# EAGLE design LCD-Shield (EAGLE 9.4.0)
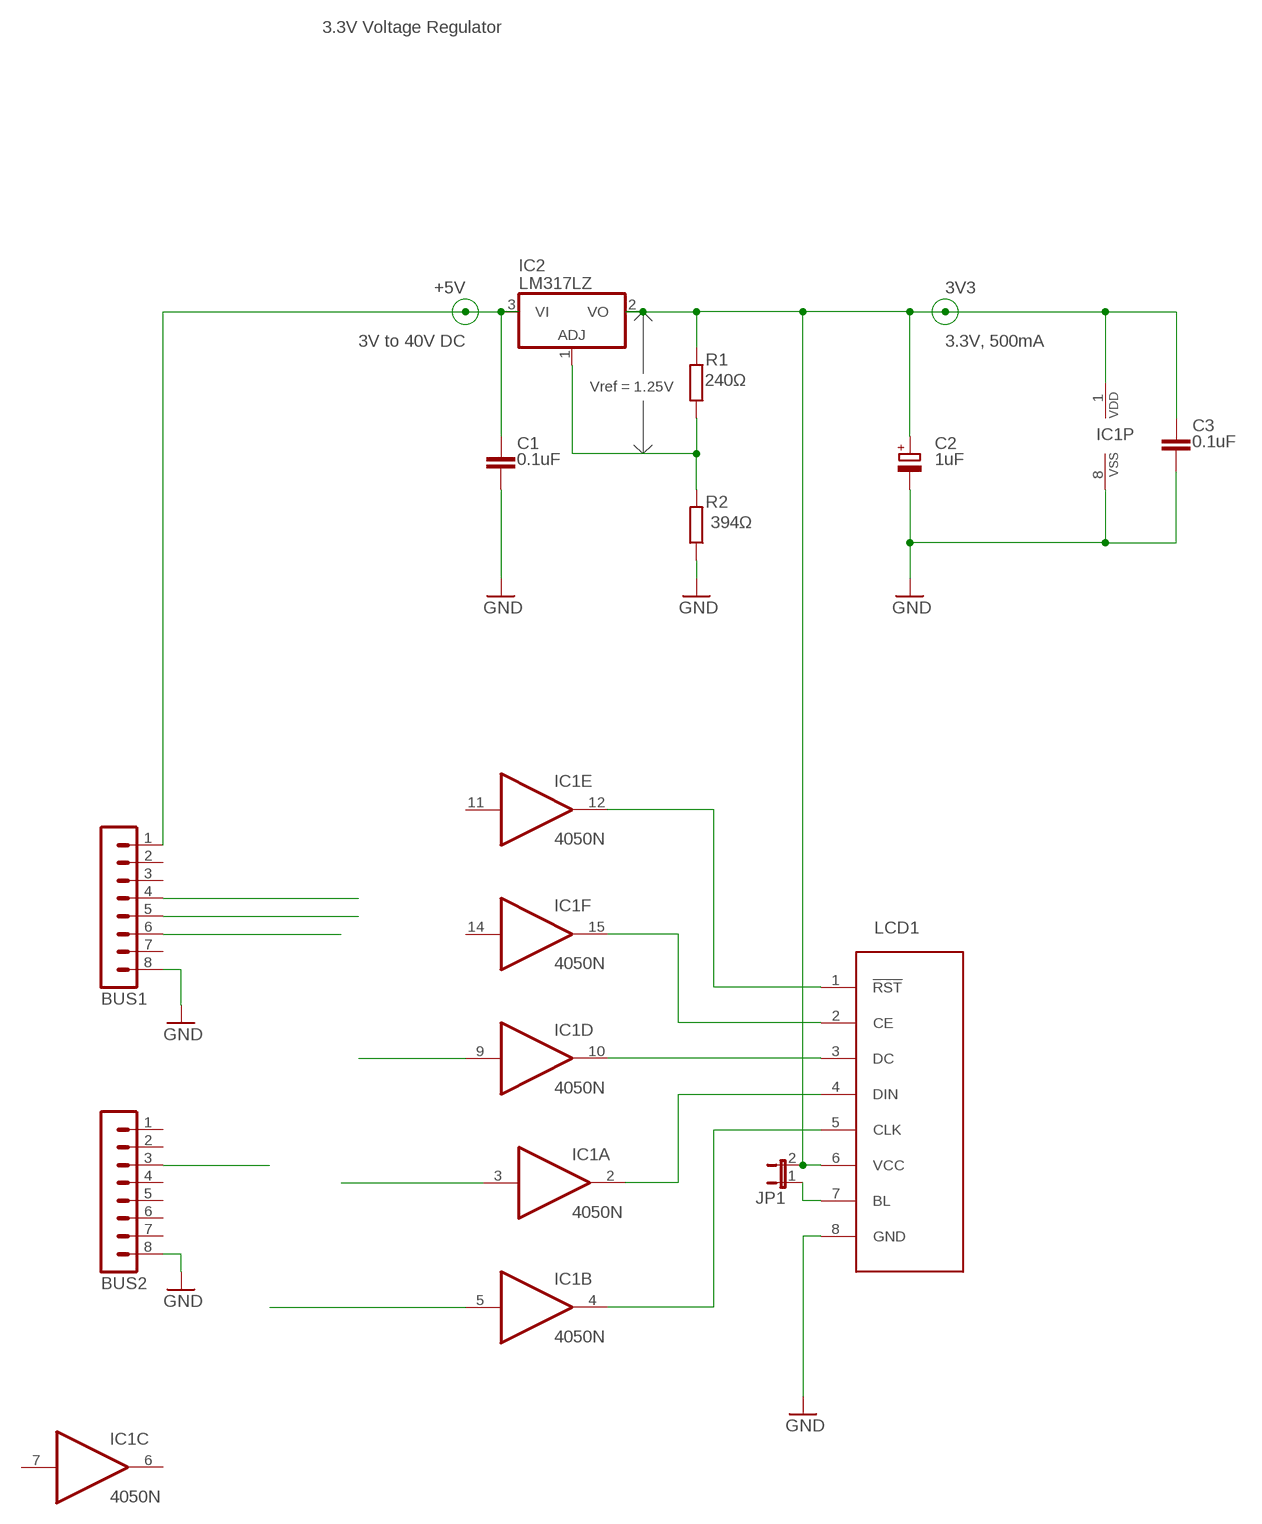
[diagram p0: schematic, sheet 1]

## Parts
BUS1  MA08-1  [MA08-1]
BUS2  MA08-1  [MA08-1]
C1  0.1uF  C-EU025-024X044  [C025-024X044]
C2  1uF  CPOL-EUE2-4  [E2-4]
C3  0.1uF  C-EU025-024X044  [C025-024X044]
IC1  4050N  [DIL16]
IC2  LM317LZ  [TO92]
JP1  JP1E  [JP1]
LCD1  5110_LCD_NOKIA  [LCD_5110]
R1  240Ω  R-EU_0207/7  [0207/7]
R2  394Ω  R-EU_0207/7  [0207/7]

## Nets
3V3: C2.+ C3.1 IC1.1(P:VDD) IC2.2(VO) JP1.2 LCD1.6(VCC) R1.2
+5V: BUS1.1 C1.1 IC2.3(VI)
GND: BUS1.8 BUS2.8 C1.2 C2.- C3.2 IC1.8(P:VSS) LCD1.8(GND) R2.1
N$1: IC1.12(E:O) LCD1.1(!RST)
N$2: IC1.15(F:O) LCD1.2(CE)
N$3: IC1.10(D:O) LCD1.3(DC)
N$4: IC1.2(A:O) LCD1.4(DIN)
N$5: IC1.4(B:O) LCD1.5(CLK)
N$6: IC2.1(ADJ) R1.1 R2.2
N$7: BUS2.3
N$8: JP1.1 LCD1.7(BL)
N$9: BUS1.4
N$10: BUS1.5
N$11: IC1.5(B:I)
N$12: BUS1.6
N$13: IC1.3(A:I)
N$14: IC1.9(D:I)
Unconnected: BUS1.2 BUS1.3 BUS1.7 BUS2.1 BUS2.2 BUS2.4 BUS2.5 BUS2.6 BUS2.7 IC1.6(C:O) IC1.7(C:I) IC1.11(E:I) IC1.14(F:I)

## Notes on the sheet
- 3.3V Voltage Regulator
- 3V to 40V DC | 3.3V, 500mA
- Vref = 1.25V

## Library data of the parts
BUS1 BUS2 = con-lstb:MA08-1: PIN HEADER; OC_FARNELL: unknown; OC_NEWARK: unknown
C1 C3 = rcl:C-EU: CAPACITOR, European symbol
C2 = rcl:CPOL-EU: POLARIZED CAPACITOR, European symbol
IC1 = 40xx:4050: Hex non-inverting BUFFER
IC2 = linear:*317: Positive VOLTAGE REGULATOR
JP1 = jumper:JP1E: JUMPER
LCD1 = 5110_LCD:5110_LCD_NOKIA
R1 R2 = rcl:R-EU_: RESISTOR, European symbol

## Board
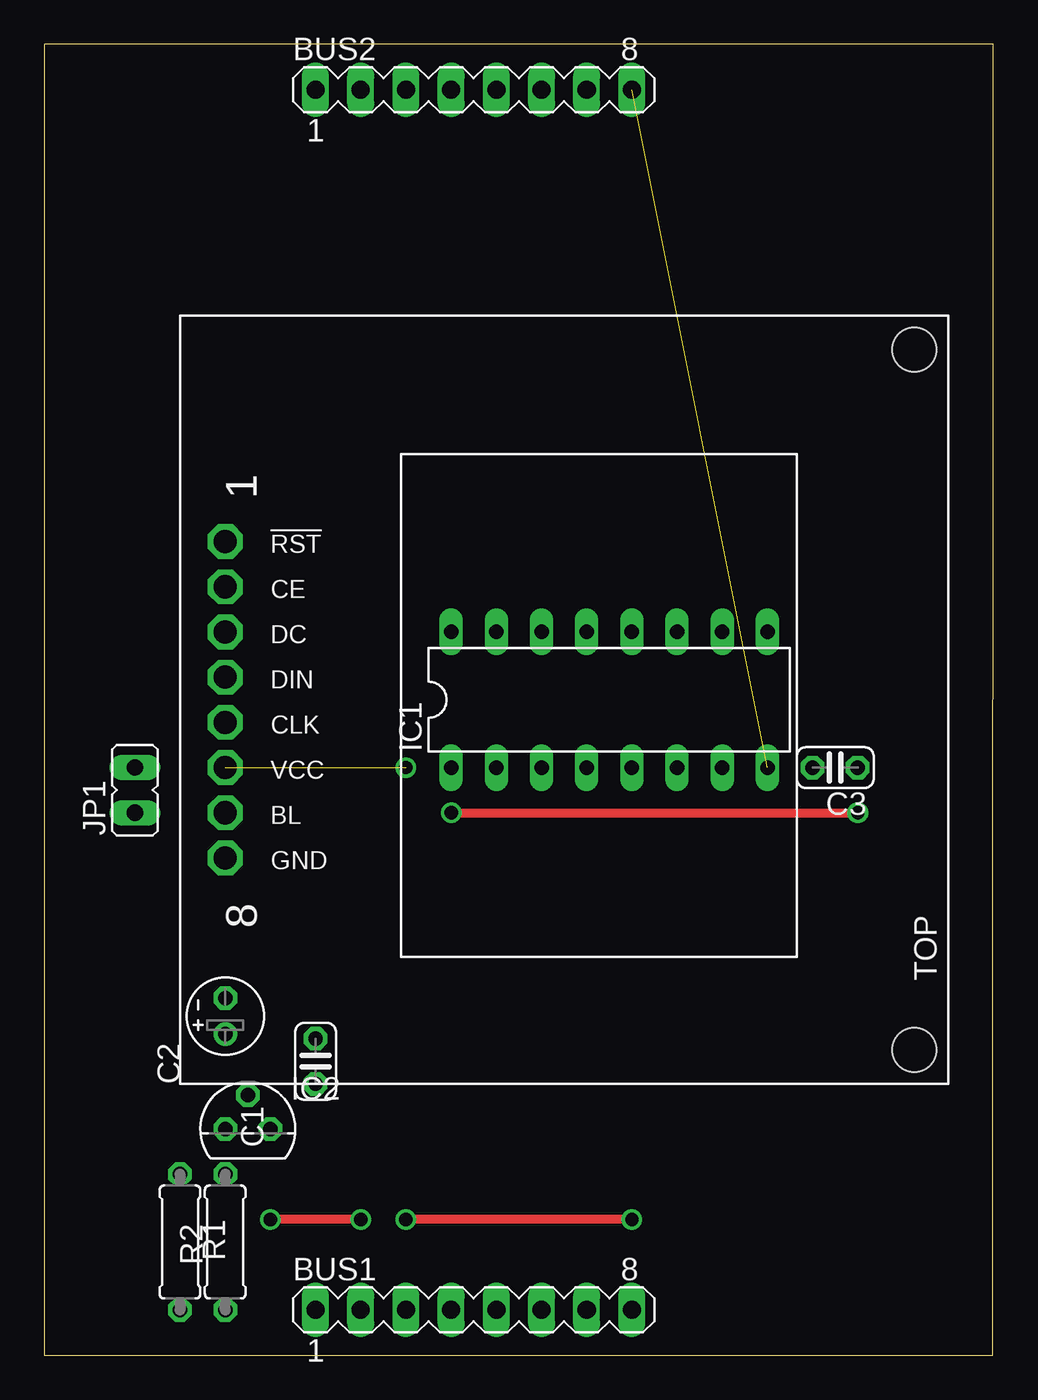
[diagram p1: board, top side]
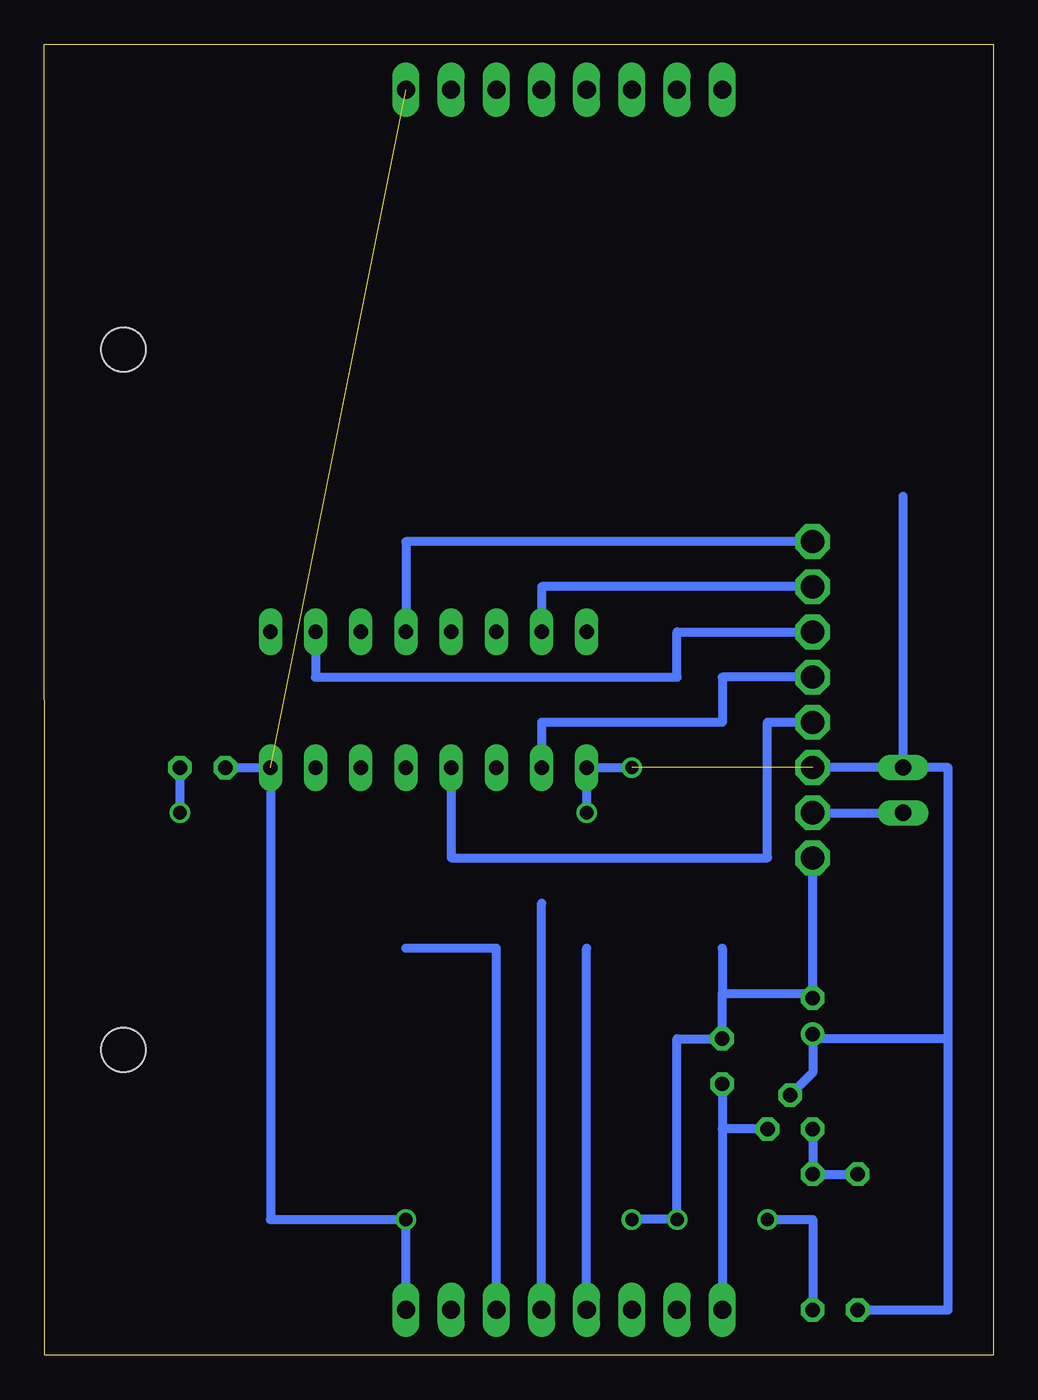
[diagram p2: board, bottom side, seen from below]

Size 53.34 x 73.66 mm. Coordinates in mm from the lower left corner, seen from the top.
Outline: 0,0 53.32,0 53.34,73.66 0,73.66 0,0
Copper layers (1*16): Top 0.035mm / dielectric 1.5mm / Bottom 0.035mm
Design rules "default": minimum track width 6mil, minimum drill 0.35mm, track to track 6mil, track to pad 6mil, pad to pad 6mil, via to via 6mil, smd to smd 6mil, copper to edge 40mil, drill to drill 6mil, minimum pad ring 10mil, minimum via ring 8mil, stop-mask expansion 4mil, vias tented up to drill 0mil, thermal gap 10mil

### Footprints (pad centres in the part's own frame; a part is rotated, then mirrored left to right if it is on the bottom)
MA08-1 = drill 1.016 long: 1 -8.89,0; 2 -6.35,0; 3 -3.81,0; 4 -1.27,0; 5 1.27,0; 6 3.81,0; 7 6.35,0; 8 8.89,0
C025-024X044 = drill 0.813 octagon: 1 -1.27,0; 2 1.27,0
E2-4 = drill 0.813 pad 1.27: + -1.016,0 | drill 0.813 pad 1.27 octagon: - 1.016,0
DIL16 = drill 0.813 long: 1 -8.89,-3.81; 2 -6.35,-3.81; 3 -3.81,-3.81; 4 -1.27,-3.81; 5 1.27,-3.81; 6 3.81,-3.81; 7 6.35,-3.81; 8 8.89,-3.81; 9 8.89,3.81; 10 6.35,3.81; 11 3.81,3.81; 12 1.27,3.81; 13 -1.27,3.81; 14 -3.81,3.81; 15 -6.35,3.81; 16 -8.89,3.81
TO92 = drill 0.813 octagon: 1 -1.27,0; 2 0,1.905; 3 1.27,0
JP1 = drill 0.914 long: 1 0,-1.27; 2 0,1.27
LCD_5110 = drill 1.3 octagon: 1 12.7,2.54; 2 15.24,2.54; 3 17.78,2.54; 4 20.32,2.54; 5 22.86,2.54; 6 25.4,2.54; 7 27.94,2.54; 8 30.48,2.54 | hole 2.5: 1.905,41.275; 41.275,41.275
0207/7 = drill 0.813 octagon: 1 -3.81,0; 2 3.81,0

### Placement (x,y rotation side)
BUS1  24.13,2.54 0 top
BUS2  24.13,71.12 0 top
C1  15.24,16.51 90 top
C2  10.16,19.05 90 top
C3  44.45,33.02 180 top
IC1  31.75,36.83 0 top
IC2  11.43,12.7 0 top
JP1  5.08,31.75 0 top
LCD1  7.62,58.42 270 top
R1  7.62,6.35 270 top
R2  10.16,6.35 90 top

### Tracks (layer width: path | path; a pad name or v marks a point on that pad's centre or on a via)
3V3  (via drill 0.75)  (1 unrouted)
  Top 0.508: v22.86,30.48 v45.72,30.48
  Bottom 0.508: C2.+ 10.16,17.78 | 10.16,17.78 10.16,15.88 IC2.2 | R1.2 2.54,2.54 2.54,17.78 | 2.54,17.78 10.16,17.78 | JP1.2 LCD1.6 | JP1.2 2.54,33.02 2.54,17.78 | 5.08,48.26 JP1.2 | v22.86,30.48 IC1.1 v20.32,33.02 | v45.72,30.48 C3.1
+5V
  Bottom 0.508: IC2.3 15.24,12.7 | 15.24,12.7 BUS1.1 | C1.1 15.24,12.7
GND  (via drill 0.75)  (1 unrouted)
  Top 0.508: v33.02,7.62 v20.32,7.62 | v17.78,7.62 v12.7,7.62
  Bottom 0.508: BUS1.8 v33.02,7.62 40.64,7.62 IC1.8 C3.2 | v12.7,7.62 10.16,7.62 R2.1 | 15.24,20.32 C1.2 17.78,17.78 v17.78,7.62 v20.32,7.62 | 15.24,20.32 10.16,20.32 C2.- LCD1.8 | 15.24,22.86 15.24,20.32
N$1
  Bottom 0.508: LCD1.1 33.02,45.72 IC1.12
N$2
  Bottom 0.508: LCD1.2 25.4,43.18 IC1.15
N$3
  Bottom 0.508: IC1.10 38.1,38.1 17.78,38.1 17.78,40.64 LCD1.3
N$4
  Bottom 0.508: LCD1.4 15.24,38.1 15.24,35.56 25.4,35.56 IC1.2
N$5
  Bottom 0.508: LCD1.5 12.7,35.56 12.7,27.94 30.48,27.94 IC1.4
N$6
  Bottom 0.508: R1.1 R2.2 IC2.1
N$8
  Bottom 0.508: LCD1.7 JP1.1
N$9
  Bottom 0.508: BUS1.4 22.86,22.86
N$10
  Bottom 0.508: BUS1.5 25.4,25.4
N$12
  Bottom 0.508: BUS1.6 27.94,22.86 33.02,22.86